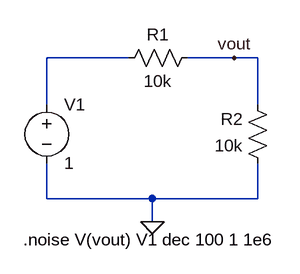
[diagram p0: schematic divider_noise.asc]
divider_noise.asc, the LTspice schematic file:
Version 4
SHEET 1 880 680
WIRE 128 128 16 128
WIRE 272 128 208 128
WIRE 304 128 272 128
WIRE 16 192 16 128
WIRE 304 192 304 128
WIRE 16 320 16 272
WIRE 160 320 16 320
WIRE 304 320 304 272
WIRE 304 320 160 320
WIRE 160 352 160 320
FLAG 160 352 0
FLAG 272 128 vout
SYMBOL res 224 112 R90
WINDOW 0 0 56 VBottom 2
WINDOW 3 32 56 VTop 2
SYMATTR InstName R1
SYMATTR Value 10k
SYMBOL res 320 288 R180
WINDOW 0 36 76 Left 2
WINDOW 3 36 40 Left 2
SYMATTR InstName R2
SYMATTR Value 10k
SYMBOL voltage 16 176 R0
WINDOW 123 0 0 Left 0
WINDOW 39 0 0 Left 0
SYMATTR InstName V1
SYMATTR Value 1
TEXT -16 376 Left 2 !.noise V(vout) V1 dec 100 1 1e6

The netlist it stands for:
* divider_noise.asc
R1 vout N001 10k
R2 0 vout 10k
V1 N001 0 1
.noise V(vout) V1 dec 100 1 1e6
.backanno
.end